# EAGLE schematic atmega (EAGLE 9.1.0)

## Sheet 1 of 2
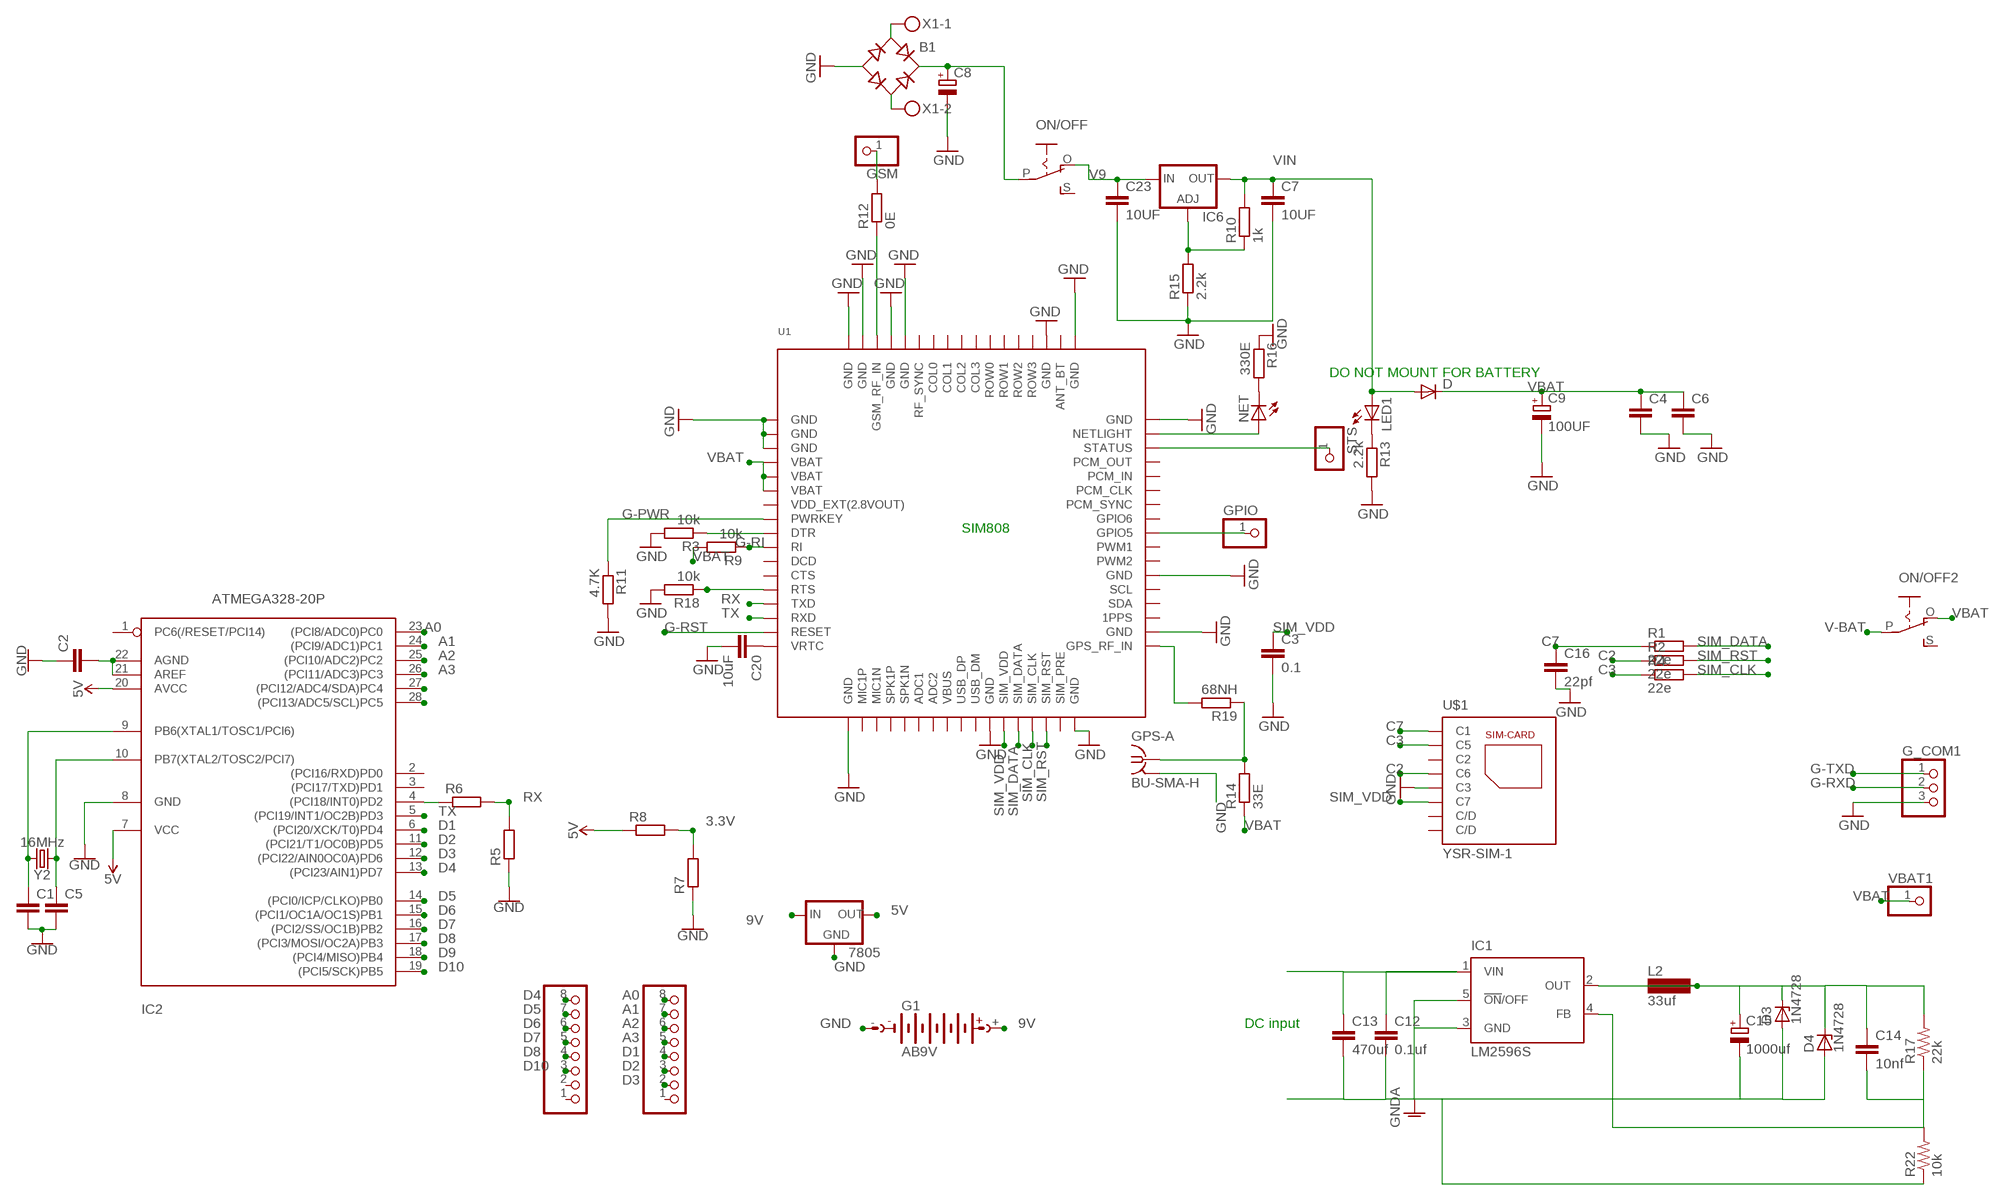
[diagram p0: schematic, sheet 1]

### Parts
7805  78LXX  [78LXX]
B1  RB1A  [RB1A]
BOARD  8x1F-H8.5  PINHD-1X8  [1X08]
BOARD1  8x1F-H8.5  PINHD-1X8  [1X08]
C1  C2,5-3  [C2.5-3]
C2  C2,5-3  [C2.5-3]
C3  0.1  C-EUC1206  [C1206]
C4  C-EUC1206  [C1206]
C5  C2,5-3  [C2.5-3]
C6  C-EUC1206  [C1206]
C7  10UF  C-EUC1206K  [C1206K]
C8  CPOL-EUE5-10.5  [E5-10,5]
C9  100UF  CPOL-EUE3.5-8  [E3,5-8]
C12  0.1uf  C2,5-3  [C2.5-3]
C13  470uf  C2,5-3  [C2.5-3]
C14  10nf  C2,5-3  [C2.5-3]
C15  1000uf  CPOL-EU085CS-1AR  [085CS_1AR]
C16  22pf  C-EUC1206  [C1206]
C20  10uF  C-EUC1206K  [C1206K]
C23  10UF  C-EUC1206  [C1206]
D  1N4004  [DO41-10]
D3  1N4728  [DO41Z10]
D4  1N4728  [DO41Z10]
G1  AB9V  [AB9V]
G_COM1  PINHD-1X3  [1X03]
GPIO  PINHD-1X1  [1X01]
GPS-A  BU-SMA-H  [BU-SMA-H]
GSM  PINHD-1X1  [1X01]
IC1  LM2596S  [TO263-5]
IC2  ATMEGA328-20P  [DIL28-3]
IC6  LM317TS  [317TS]
L2  33uf  BS11  [BS11]
LED1  LEDCHIPLED_1206  [CHIPLED_1206]
NET  LEDCHIPLED_1206  [CHIPLED_1206]
ON/OFF  EG1218S  [EG1218]
ON/OFF2  EG1218S  [EG1218]
R1  22e  R-EU_M1206  [M1206]
R2  22e  R-EU_R1206  [R1206]
R3  10k  R-EU_R1206  [R1206]
R4  22e  R-EU_R1206  [R1206]
R5  R-EU_0204/5  [0204/5]
R6  R-EU_0204/5  [0204/5]
R7  R-EU_0204/5  [0204/5]
R8  R-EU_0204/5  [0204/5]
R9  10k  R-EU_R1206  [R1206]
R10  1k  R-EU_R1206  [R1206]
R11  4.7K  R-EU_R1206  [R1206]
R12  0E  R-EU_R1206  [R1206]
R13  2.2k  R-EU_R1206  [R1206]
R14  33E  R-EU_R1206  [R1206]
R15  2.2k  R-EU_R1206  [R1206]
R16  330E  R-EU_R1206  [R1206]
R17  22k  R-US_0204/2V  [0204V]
R18  10k  R-EU_R1206  [R1206]
R19  68NH  R-EU_R1206  [R1206]
R22  10k  R-US_0204/2V  [0204V]
STS  PINHD-1X1  [1X01]
U1  GSM_SIM808_LITERAL  [SIM900_SMT]
U$1  YSR-SIM-1  [5036_006_200_862]
VBAT1  PINHD-1X1  [1X01]
X1  MKDSN1,5/2-5,08  [MKDSN1,5/2-5,08]
Y2  16MHz  CRYSTAL-16MHZPTH-HC49US  [HC49US]

### Nets
3.3V: R7.2 R8.2
5V: 7805.OUT IC2.7(VCC) IC2.20(AVCC) R8.1
9V: 7805.IN G1.+
A0: BOARD1.8 IC2.23((PCI8/ADC0)PC0)
A1: BOARD1.7 IC2.24((PCI9/ADC1)PC1)
A2: BOARD1.6 IC2.25((PCI10/ADC2)PC2)
A3: BOARD1.5 IC2.26((PCI11/ADC3)PC3)
C2: R2.1 U$1.C6
C3: R4.1 U$1.C5
C7: C16.1 R1.1 U$1.C1
D1: BOARD1.4 IC2.6((PCI20/XCK/T0)PD4)
D2: BOARD1.3 IC2.11((PCI21/T1/OC0B)PD5)
D3: BOARD1.2 IC2.12((PCI22/AIN0OC0A)PD6)
D4: BOARD.8 IC2.13((PCI23/AIN1)PD7)
D5: BOARD.7 IC2.14((PCI0/ICP/CLKO)PB0)
D6: BOARD.6 IC2.15((PCI1/OC1A/OC1S)PB1)
D7: BOARD.5 IC2.16((PCI2/SS/OC1B)PB2)
D8: BOARD.4 IC2.17((PCI3/MOSI/OC2A)PB3)
D9: IC2.18((PCI4/MISO)PB4)
D10: BOARD.3 IC2.19((PCI5/SCK)PB5)
G-PWR: R11.1 U1.P$8(PWRKEY)
G-RI: R9.1 U1.P$10(RI)
G-RST: U1.P$16(RESET)
G-RXD: G_COM1.2
G-TXD: G_COM1.1
GND: 7805.GND B1.- C1.2 C2.1 C3.2 C4.2 C5.2 C6.2 C7.2 C8.- C9.- C16.2 C20.2 C23.2 G1.- G_COM1.3 GPS-A.2 GPS-A.3 GPS-A.4 GPS-A.5 IC2.8(GND) R3.2 R5.1 R7.1 R11.2 R13.2 R15.1 R16.1 R18.2 U1.P$1(GND) U1.P$2(GND) U1.P$3(GND) U1.P$18(GND) U1.P$28(GND) U1.P$34(GND) U1.P$36(GND) U1.P$40(GND) U1.P$51(GND) U1.P$52(GND) U1.P$54(GND) U1.P$64(GND) U1.P$65(GND) U1.P$67(GND) U1.P$68(GND) U$1.C3
GNDA: C12.2 C13.2 C15.- D3.A D4.A IC1.3(GND) IC1.5(!ON!/OFF) R22.1
N$1: IC2.4((PCI18/INT0)PD2) R6.1
N$2: GPS-A.1 R14.2 R19.1
N$3: R3.1 U1.P$9(DTR)
N$5: NET.A U1.P$50(NETLIGHT)
N$6: STS.1 U1.P$49(STATUS)
N$7: R18.1 U1.P$13(RTS)
N$8: NET.C R16.2
N$11: C2.2 IC2.21(AREF) IC2.22(AGND)
N$12: IC2.27((PCI12/ADC4/SDA)PC4)
N$13: B1.+ C8.+ ON/OFF.P
N$14: B1.AC1 X1.1
N$15: GPIO.1 U1.P$43(GPIO5)
N$17: C14.1 C15.+ D3.C D4.C IC1.2(OUT) L2.1 L2.2 R17.2
N$18: C20.1 U1.P$17(VRTC)
N$19: B1.AC2 X1.2
N$20: C14.2 IC1.4(FB) R17.1 R22.2
N$21: C12.1 C13.1 IC1.1(VIN)
N$22: GSM.1 R12.2
N$26: LED1.C R13.1
N$34: R12.1 U1.P$66(GSM_RF_IN)
N$38: R19.2 U1.P$35(GPS_RF_IN)
N$43: C5.1 IC2.10(PB7(XTAL2/TOSC2/PCI7)) Y2.1
N$44: IC6.1(ADJ) R10.1 R15.2
N$45: C1.1 IC2.9(PB6(XTAL1/TOSC1/PCI6)) Y2.2
RX: R5.2 R6.2 U1.P$14(TXD)
SCL: IC2.28((PCI13/ADC5/SCL)PC5)
SIM_CLK: R4.2 U1.P$31(SIM_CLK)
SIM_DATA: R1.2 U1.P$30(SIM_DATA)
SIM_RST: R2.2 U1.P$32(SIM_RST)
SIM_VDD: C3.1 U1.P$29(SIM_VDD) U$1.C7
TX: IC2.5((PCI19/INT1/OC2B)PD3) U1.P$15(RXD)
V9: C23.1 IC6.3(IN) ON/OFF.O
V-BAT: ON/OFF2.P
VBAT: C4.1 C6.1 C9.+ D.C ON/OFF2.O R9.2 R14.1 U1.P$4(VBAT) U1.P$5(VBAT) U1.P$6(VBAT) VBAT1.1
VIN: C7.1 D.A IC6.2(OUT) LED1.A R10.2
Unconnected: BOARD1.1 BOARD.1 BOARD.2 IC2.1(PC6(/RESET/PCI14)) IC2.2((PCI16/RXD)PD0) IC2.3((PCI17/TXD)PD1) ON/OFF2.S ON/OFF.S U1.P$11(DCD) U1.P$12(CTS) U1.P$19(MIC1P) U1.P$20(MIC1N) U1.P$21(SPK1P) U1.P$22(SPK1N) U1.P$23(ADC1) U1.P$24(ADC2) U1.P$26(USB_DP) U1.P$27(USB_DM) U1.P$33(SIM_PRE) U1.P$37(1PPS) U1.P$38(SDA) U1.P$39(SCL) U1.P$41(PWM2) U1.P$42(PWM1) U1.P$44(GPIO6) U1.P$45(PCM_SYNC) U1.P$46(PCM_CLK) U1.P$47(PCM_IN) U1.P$48(PCM_OUT) U1.P$53(ANT_BT) U1.P$55(ROW3) U1.P$56(ROW2) U1.P$57(ROW1) U1.P$58(ROW0) U1.P$59(COL3) U1.P$60(COL2) U1.P$61(COL1) U1.P$62(COL0) U1.P$63(RF_SYNC) U$1.C2 U$1.C/D@1(C/D) U$1.C/D@2(C/D)

### Notes on the sheet
- DO NOT MOUNT FOR BATTERY
- SIM808
- DC input

## Sheet 2 of 2

## Power pins joined to a net without a drawn wire
VBUS: U1.P$25(VBUS)
VDD_EXT(2.8VOUT): U1.P$7(VDD_EXT(2.8VOUT))

## Library data of the parts
7805 = v-reg:78LXX: VOLTAGE REGULATOR
B1 = rectifier:RB1A: RECTIFIER 1 A
BOARD BOARD1 = SmartPrj:PINHD-1X8: PIN HEADER
C1 C2 C5 C12-C14 = capacitor-wima:C: CAPACITOR naming: grid - package width
C3 C16 C23 = rcl:C-EU: CAPACITOR, European symbol
C4 C6 C7 C20 = resistor:C-EU: CAPACITOR, European symbol
C8 C9 = resistor:CPOL-EU: POLARIZED CAPACITOR, European symbol
C15 = rcl:CPOL-EU: POLARIZED CAPACITOR, European symbol
D = diode:1N4004: DIODE general purpose rectifier, 1 A
D3 D4 = diode:1N4728: Z DIODE 3.3 V, 1W, 5 percent
G1 = battery:AB9V: 9-V BATTERY CLIP
G_COM1 = pinhead:PINHD-1X3: PIN HEADER
GPIO GSM STS VBAT1 = pinhead:PINHD-1X1: PIN HEADER
GPS-A = con-coax:BU-SMA-H: FEMALE SMA CONNECTOR Radiall; OC_FARNELL: unknown; OC_NEWARK: unknown
IC1 = national-semiconductor (1):LM2596: SIMPLE SWITCHER® Power Converter 150 kHz 3A Step-Down Voltage Regulator Source: http://www.national.com/ds/LM/LM2596.pdf; MF: NATIONAL SEMICONDUCTOR; MPN: LM2596S-ADJ/NOPB; OC_FARNELL: 9494367; OC_NEWARK: 41K3842
IC2 = atmega328:ATMEGA328*P: MICROCONTROLLER 32 kBytes FLASH 2 kBytes SRAM 1 kBytes EEPROM USART 8-channel 10 bit ADC
IC6 = v-reg:LM317TS: VOLTAGE REGULATOR
L2 = inductor-neosid:BS: INDUCTOR nominal inductance, magnetically screened; OC_FARNELL: unknown; OC_NEWARK: unknown
LED1 NET = led:LED: LED OSRAM: - CHIPLED LG R971, LG N971, LY N971, LG Q971, LY Q971, LO R971, LY R971 LH N974, LH R974 LS Q976, LO Q976, LY Q976 LO Q996 - Hyper CHIPLED LW Q18S LB Q993, LB Q99A, LB R99A - SideLED LS A670, LO A670, LY A670, LG A670, LP A670 LB A673, LV A673, LT A673, LW A673 LH A674 LY A675 LS A676, LA A676, LO A676, LY A676, LW A676 LS A679, LY A679, LG A679 - Hyper Micro SIDELED® LS Y876, LA Y876, LO Y876, LY Y876 LT Y87S - SmartLED LW L88C, LW L88S LB L89C, LB L89S, LG L890 LS L89K, LO L89K, LY L89K LS L896, LA L896, LO L896, LY L896 - TOPLED LS T670, LO T670, LY T670, LG T670, LP T670 LSG T670, LSP T670, LSY T670, LOP T670, LYG T670 LG T671, LOG T671, LSG T671 LB T673, LV T673, LT T673, LW T673 LH T674 LS T676, LA T676, LO T676, LY T676, LB T676, LH T676, LSB T676, LW T676 LB T67C, LV T67C, LT T67C, LS T67K, LO T67K, LY T67K, LW E67C LS E67B, LA E67B, LO E67B, LY E67B, LB E67C, LV E67C, LT E67C LW T67C LS T679, LY T679, LG T679 LS T770, LO T770, LY T770, LG T770, LP T770 LB T773, LV T773, LT T773, LW T773 LH T774 LS E675, LA E675, LY E675, LS T675 LS T776, LA T776, LO T776, LY T776, LB T776 LHGB T686 LT T68C, LB T68C - Hyper Mini TOPLED® LB M676 - Mini TOPLED Santana® LG M470 LS M47K, LO M47K, LY M47K Source: http://www.osram.convergy.de LUXEON: - LUMILED® LXK2-PW12-R00, LXK2-PW12-S00, LXK2-PW14-U00, LXK2-PW14-V00 LXK2-PM12-R00, LXK2-PM12-S00, LXK2-PM14-U00 LXK2-PE12-Q00, LXK2-PE12-R00, LXK2-PE12-S00, LXK2-PE14-T00, LXK2-PE14-U00 LXK2-PB12-K00, LXK2-PB12-L00, LXK2-PB12-M00, LXK2-PB14-N00, LXK2-PB14-P00, LXK2-PB14-Q00 LXK2-PR12-L00, LXK2-PR12-M00, LXK2-PR14-Q00, LXK2-PR14-R00 LXK2-PD12-Q00, LXK2-PD12-R00, LXK2-PD12-S00 LXK2-PH12-R00, LXK2-PH12-S00 LXK2-PL12-P00, LXK2-PL12-Q00, LXK2-PL12-R00 Source: www.luxeon.com KINGBRIGHT: KA-3528ASYC Source: www.kingbright.com
ON/OFF ON/OFF2 = adafruit:EG1218: SLIDING SWITCH 0.1" spacing through hole, vertical SPDT slide switch http://www.ladyada.net/library/pcb/eaglelibrary.html
R1-R4 R9-R16 R18 R19 = rcl:R-EU_: RESISTOR, European symbol
R5-R8 = resistor:R-EU_: RESISTOR, European symbol
R17 R22 = rcl:R-US_: RESISTOR, American symbol
U1 = adafruit:GSM_SIM808_LITERAL: SIM808 GSM Module
U$1 = SIM-YSR:YSR-SIM-1
X1 = con-phoenix-508:MKDSN1,5/2-5,08: MKDSN 1,5/ 2-5,08 Printklemme Nennstrom: 13,5 A Nennspannung: 250 V Rastermaß: 5,08 mm Polzahl: 2 Anschlussart: Schraubanschluss Montage: Löten Anschlussrichtung Leiter/Platine: 0 ° Artikelnummer: 1729128 Source: http://eshop.phoenixcontact.com .. 1729128.pdf; MPN: MKDSN 1,5/2-5.08; OC_FARNELL: 1792903; OC_NEWARK: 30M2397
Y2 = SparkFun-Clocks:CRYSTAL-16MHZ: 16MHz Crystal Digikey Example <http://www.digikey.com/product-search/en?keywords=535-9122-1-ND> Frequency: 16MHz Frequency Stability: ±50ppm Frequency Tolerance: ±20ppm Load Capacitance: 18pF SparkFun Products: Pro Micro -5V/16MHz <https://www.sparkfun.com/products/12640> SparkFun Serial Enabled LCD Kit <https://www.sparkfun.com/products/10097>; PROD_ID: XTAL-08181; SF_ID: COM-00536